# EAGLE design meduza01 (EAGLE 6.3)
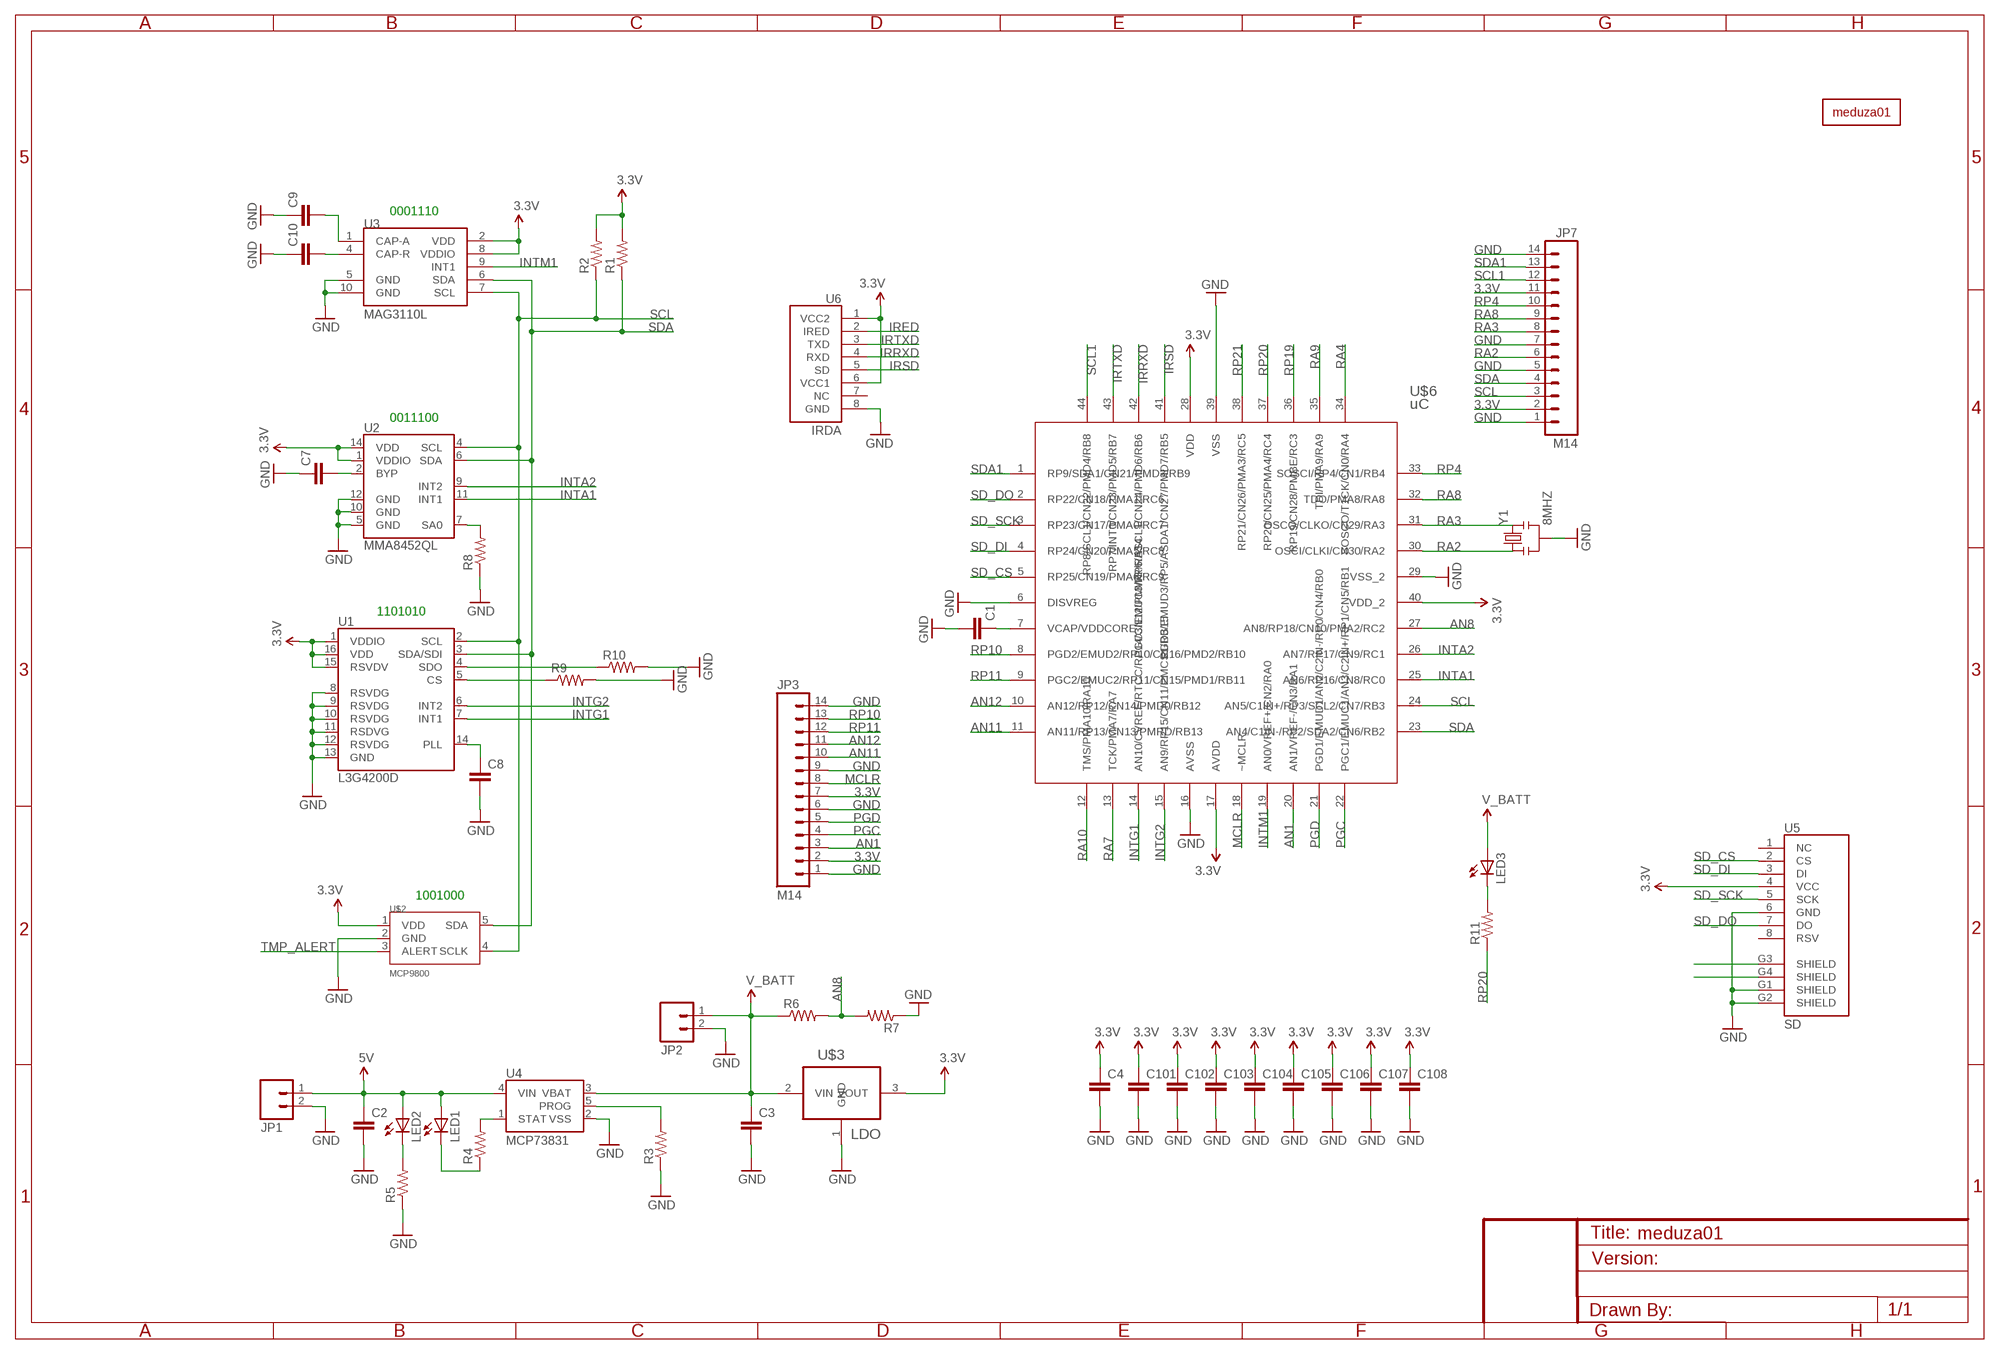
[diagram p0: schematic, sheet 1]

## Parts
C1  CAP0603  [0603]
C2  CAP0805  [0805]
C3  CAP0805  [0805]
C4  CAP0603  [0603]
C7  CAP0603  [0603]
C8  CAP0603  [0603]
C9  CAP0603  [0603]
C10  CAP0603  [0603]
C101  CAP0603  [0603]
C102  CAP0603  [0603]
C103  CAP0603  [0603]
C104  CAP0603  [0603]
C105  CAP0603  [0603]
C106  CAP0603  [0603]
C107  CAP0603  [0603]
C108  CAP0603  [0603]
JP1  M02PTH  [1X02]
JP2  M02PTH  [1X02]
JP3  M14  [1X14]
JP7  M14  [1X14]
LED1  LED1206  [LED-1206]
LED2  LED1206  [LED-1206]
LED3  LED1206  [LED-1206]
R1  RESISTOR0603  [0603]
R2  RESISTOR0603  [0603]
R3  RESISTOR0603  [0603]
R4  RESISTOR0603  [0603]
R5  RESISTOR0603  [0603]
R6  RESISTOR0603  [0603]
R7  RESISTOR0603  [0603]
R8  RESISTOR0603  [0603]
R9  RESISTOR0603  [0603]
R10  RESISTOR0603  [0603]
R11  RESISTOR0603  [0603]
U1  L3G4200D  [LGA16-4X4]
U2  MMA8452QL  [QFN-16_0.5MM-EXTRA]
U3  MAG3110L  [DFN-10-EXTRA]
U4  MCP73831  [SOT23-5]
U5  SD  USD-SOCKETMOLEX47309  [MOLEX-SD-47309]
U6  IRDA  TFDU6300TFDU6300  [TFDU6300]
U$1  MEDUZA01  [MEDUZA01]
U$2  MCP9800  [SOT23-5]
U$3  LDO  MCP1700T-3302E/TTSOT89MCP1700-3N  [SOT89R]
U$6  uC  PIC24FJ64GA004  [QFP80P1200X1200X120-44N]
Y1  8MHZ  RESONATOR8MHZ  [RESONATOR-SMD]

## Nets
3.3V: C4.1 C101.1 C102.1 C103.1 C104.1 C105.1 C106.1 C107.1 C108.1 JP3.2 JP3.7 JP7.2 JP7.11 R1.2 R2.2 U1.1(VDDIO) U1.15(RSVDV) U1.16(VDD) U2.1(VDDIO) U2.14(VDD) U3.2(VDD) U3.8(VDDIO) U5.4(VCC) U6.1(VCC2) U6.6(VCC1) U$2.1(VDD) U$3.3(VOUT) U$6.17(AVDD) U$6.28(VDD) U$6.40(VDD_2)
5V: C2.1 JP1.1 LED1.A LED2.A U4.4(VIN)
ABYP: C7.2 U2.2(BYP)
AN1: JP3.3 U$6.20(AN1/VREF-/CN3/RA1)
AN8: R6.2 R7.2 U$6.27(AN8/RP18/CN10/PMA2/RC2)
AN11: JP3.10 U$6.11(AN11/RP13/CN13/PMRD/RB13)
AN12: JP3.11 U$6.10(AN12/RP12/CN14/PMD0/RB12)
GCS: R9.1 U1.5(CS)
GND: C1.2 C2.2 C3.2 C4.2 C7.1 C8.2 C9.1 C10.1 C101.2 C102.2 C103.2 C104.2 C105.2 C106.2 C107.2 C108.2 JP1.2 JP2.2 JP3.1 JP3.6 JP3.9 JP3.14 JP7.1 JP7.5 JP7.7 JP7.14 R3.1 R5.1 R7.1 R8.1 R9.2 R10.2 U1.8(RSVDG) U1.9(RSVDG) U1.10(RSVDG) U1.11(RSDVG) U1.12(RSVDG) U1.13(GND) U2.5(GND) U2.10(GND) U2.12(GND) U3.5(GND) U3.10(GND) U4.2(VSS) U5.6(GND) U5.G1(SHIELD) U5.G2(SHIELD) U6.8(GND) U$2.2(GND) U$3.1(GND) U$6.6(DISVREG) U$6.16(AVSS) U$6.29(VSS_2) U$6.39(VSS) Y1.2
GPLL: C8.1 U1.14(PLL)
GSDO: R10.1 U1.4(SDO)
INTA1: U2.11(INT1) U$6.25(AN6/RP16/CN8/RC0)
INTA2: U2.9(INT2) U$6.26(AN7/RP17/CN9/RC1)
INTG1: U1.7(INT1) U$6.14(AN10/CVREF/RTCC/RP14/CN12/PMWR/RB14)
INTG2: U1.6(INT2) U$6.15(AN9/RP15/CN11/PMCS1/RB15)
INTM1: U3.9(INT1) U$6.19(AN0/VREF+/CN2/RA0)
IRED: U6.2(IRED)
IRRXD: U6.4(RXD) U$6.42(PGC3/EMUC3/RP6/ASCL1/CN24/PMD6/RB6)
IRSD: U6.5(SD) U$6.41(PGD3/EMUD3/RP5/ASDA1/CN27/PMD7/RB5)
IRTXD: U6.3(TXD) U$6.43(RP7/INT0/CN23/PMD5/RB7)
MCAPA: C9.2 U3.1(CAP-A)
MCAPR: C10.2 U3.4(CAP-R)
MCLR: JP3.8 U$6.18(~MCLR)
N$1: C1.1 U$6.7(VCAP/VDDCORE)
N$2: LED3.C R11.2
N$8: LED1.C R4.1
N$10: LED2.C R5.2
N$12: U5.G3(SHIELD)
N$13: U5.G4(SHIELD)
PGC: JP3.4 U$6.22(PGC1/EMUC1/AN3/C2IN+/RP1/CN5/RB1)
PGD: JP3.5 U$6.21(PGD1/EMUD1/AN2/C2IN-/RP0/CN4/RB0)
PROG: R3.2 U4.5(PROG)
RA2: JP7.6 U$6.30(OSCI/CLKI/CN30/RA2) Y1.1
RA3: JP7.8 U$6.31(OSCO/CLKO/CN29/RA3) Y1.3
RA4: U$6.34(SOSCO/T1CK/CN0/RA4)
RA7: U$6.13(TCK/PMA7/RA7)
RA8: JP7.9 U$6.32(TDO/PMA8/RA8)
RA9: U$6.35(TDI/PMA9/RA9)
RA10: U$6.12(TMS/PMA10/RA10)
RP4: JP7.10 U$6.33(SOSCI/RP4/CN1/RB4)
RP10: JP3.13 U$6.8(PGD2/EMUD2/RP10/CN16/PMD2/RB10)
RP11: JP3.12 U$6.9(PGC2/EMUC2/RP11/CN15/PMD1/RB11)
RP19: U$6.36(RP19/CN28/PMBE/RC3)
RP20: R11.1 U$6.37(RP20/CN25/PMA4/RC4)
RP21: U$6.38(RP21/CN26/PMA3/RC5)
SA0 [POWER]: R8.2 U2.7(SA0)
SCL: JP7.3 R2.1 U1.2(SCL) U2.4(SCL) U3.7(SCL) U$2.4(SCLK) U$6.24(AN5/C1IN+/RP3/SCL2/CN7/RB3)
SCL1: JP7.12 U$6.44(RP8/SCL1/CN22/PMD4/RB8)
SD_CS: U5.2(CS) U$6.5(RP25/CN19/PMA6/RC9)
SD_DI: U5.3(DI) U$6.4(RP24/CN20/PMA5/RC8)
SD_DO: U5.7(DO) U$6.2(RP22/CN18/PMA1/RC6)
SD_SCK: U5.5(SCK) U$6.3(RP23/CN17/PMA0/RC7)
SDA: JP7.4 R1.1 U1.3(SDA/SDI) U2.6(SDA) U3.6(SDA) U$2.5(SDA) U$6.23(AN4/C1IN-/RP2/SDA2/CN6/RB2)
SDA1: JP7.13 U$6.1(RP9/SDA1/CN21/PMD3/RB9)
STAT: R4.2 U4.1(STAT)
TMP_ALERT: U$2.3(ALERT)
V_BATT: C3.1 JP2.1 LED3.A R6.1 U4.3(VBAT) U$3.2(VIN)
Unconnected: U5.1(NC) U5.8(RSV) U6.7(NC)

## Notes on the sheet
- 0001110
- 0011100
- 1101010
- 1001000

## Library data of the parts
C1 C4 C7-C10 C101-C108 = naut:CAP: Capacitor
C2 C3 = SparkFun-Passives:CAP: Capacitor
JP1 JP2 = SparkFun-Connectors:M02: Header 2 Standard 2-pin 0.1" header. Use with straight break away headers (SKU : PRT-00116), right angle break away headers (PRT-00553), swiss pins (PRT-00743), machine pins (PRT-00117), and female headers (PRT-00115). Molex polarized connector foot print use with SKU : PRT-08233 with associated crimp pins and housings.
JP3 JP7 = SparkFun-Connectors:M14: Header 14 Standard 14-pin 0.1" header. Use with straight break away headers (SKU : PRT-00116), right angle break away headers (PRT-00553), swiss pins (PRT-00743), machine pins (PRT-00117), and female headers (PRT-00115).
LED1-LED3 = SparkFun-LED:LED: LEDs Standard schematic elements and footprints for 5mm, 3mm, 1206, and 0603 sized LEDs. 5mm - Spark Fun Electronics SKU : COM-00529 (and others)
R1-R11 = naut:RESISTOR: Resistor
U1 = naut:L3G4200D: L3G4200D Three-axis, digital output gyroscope The L3G4200D is a low-power three-axis angular rate sensor, has a full scale of ±250/±500/±2000 dps and is capable of measuring rates with a user-selectable bandwidth. It includes a sensing element and an IC interface capable of providing the measured angular rate to the external world through a digital interface (I2C/SPI). Package: 4x4x1.1 LGA-16 (LGA16-4x4.PAC)
U2 = naut:MMA8452Q: MMA8452Q 3-Axis, 12/8-bit Digital Accelerometer Supply Voltage: 1.6-3.6V Range: +/- 2g, 4g, 8g Interface: I2C, 12-bit and 8-bit ODR: 1.56 Hz - 800 Hz Package: QFN-16 http://cache.freescale.com/files/sensors/doc/data_sheet/MMA8452Q.pdf
U3 = naut:MAG3110: 3-axis digital (I2C) magnetometer
U4 = SparkFun-PowerIC:MCP73831: Miniature single cell, fully integrated Li-Ion, Li-polymer charge management controller http://ww1.microchip.com/downloads/en/DeviceDoc/21984a.pdf
U5 = naut:USD-SOCKET: microSD Socket Push-push type uSD socket. Schematic element and footprint production proven. Spark Fun Electronics SKU : PRT-00127. tDoc lines correctly indicate media card edge positions when inserting (unlocked, locked, depressed).
U6 = naut:TFDU6300: IRDA
U$1 = naut:MEDUZA01
U$2 = naut:MCP9800: High-Accuracy Temperature Sensor; DESCRIPTION: High-Accuracy Temperature Sensor; MPN: MCP9800; PACKAGE: SSOT23-5; SUPPLIER: MICROCHIP
U$3 = naut:MCP1700T-3302E/TT: Low Quiescent Current LDO
U$6 = naut:PIC24FJ64GA004: 16-Bit Flash Microcontrollers; DESCRIPTION: 16-Bit Flash Microcontrollers; MPN: PIC24FJ64GA004-I/PT; OC_FARNELL: 1332299; OC_NEWARK: 88K6136; PACKAGE: TQFP-44; SUPPLIER: Microchip
Y1 = SparkFun-FreqCtrl:RESONATOR: Resonator Small SMD resonator. Used, eg, on the Arduino Pro/ Pro Mini boards. 8MHz- XTAL-08895 16MHz- XTAL-08900; PROD_ID: XTAL-08895

## Net classes
0 default: width 0.305 mm, drill 0.381 mm, clearance 0.305 mm
1 POWER: width 0.61 mm, drill 0.762 mm, clearance 0.61 mm

## Board
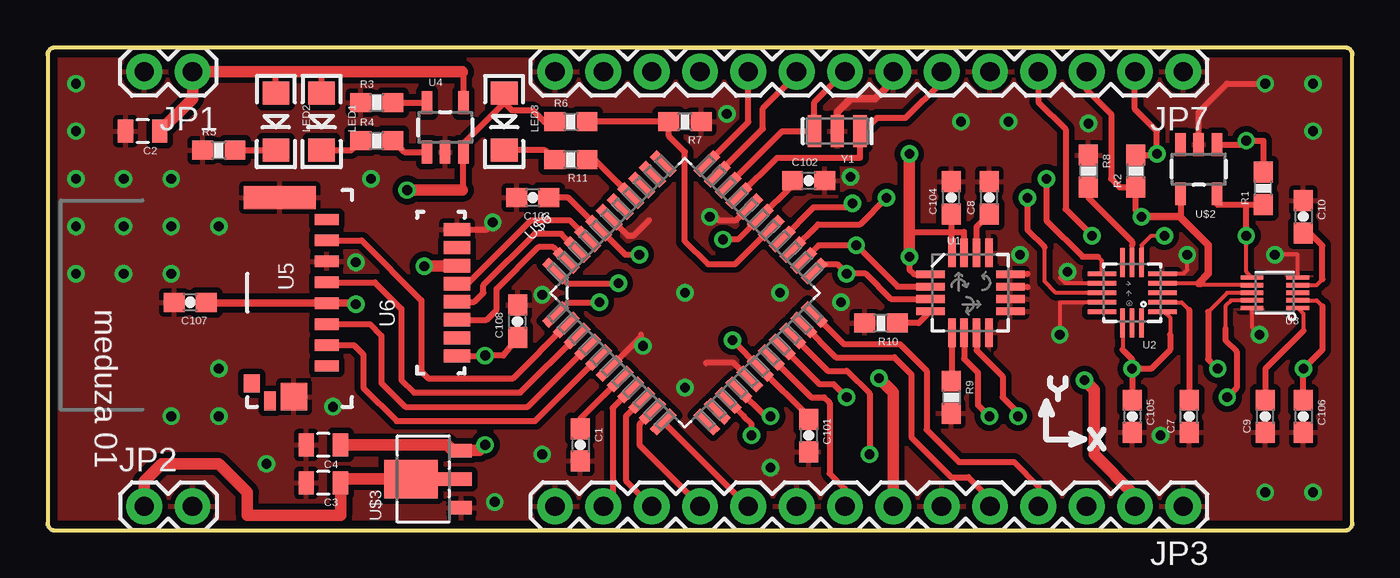
[diagram p1: board, top side]
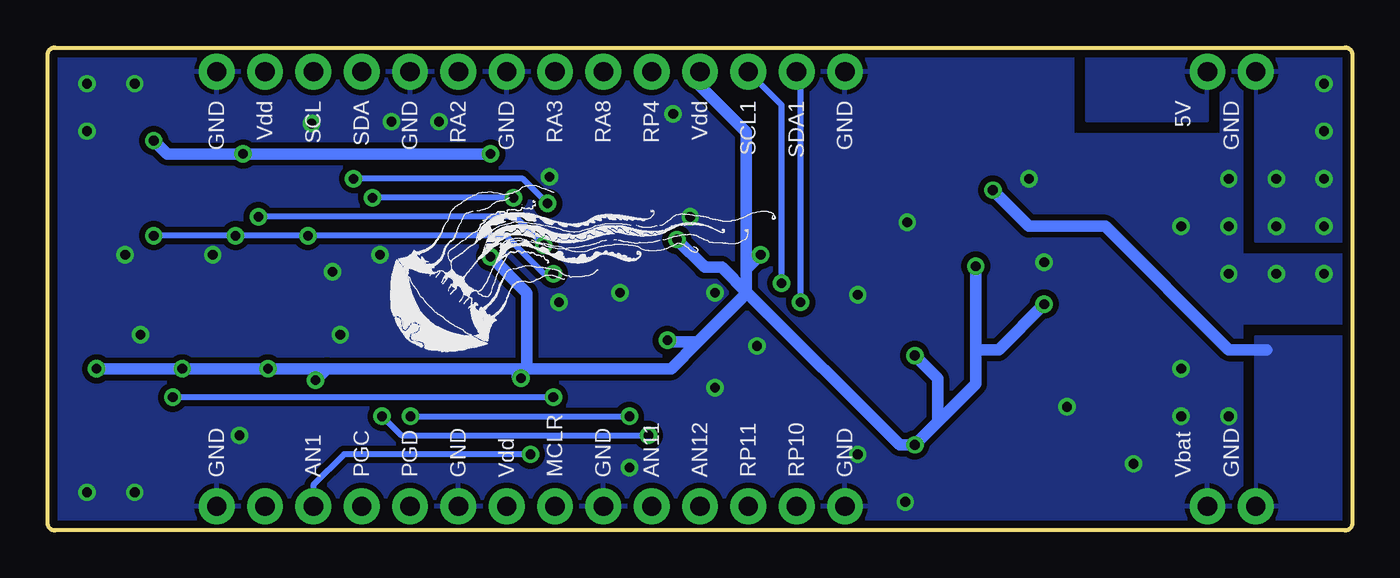
[diagram p2: board, bottom side, seen from below]

Size 68.58 x 25.4 mm. Coordinates in mm from the lower left corner, seen from the top.
Outline: 0.38,0 68.2,0 arc90 68.58,0.38 68.58,25.02 arc90 68.2,25.4 0.38,25.4 arc90 0,25.02 0,0.38 arc90 0.38,0
Copper layers (1*16): Top 0.035mm / dielectric 1.5mm / Bottom 0.035mm
Design rules "default *": minimum track width 8mil, minimum drill 20mil, track to track 8mil, track to pad 8mil, pad to pad 8mil, via to via 8mil, smd to smd 8mil, copper to edge 16mil, drill to drill 8mil, minimum pad ring 10mil, minimum via ring 8mil, stop-mask expansion 4mil, vias tented up to drill 20mil, thermal gap 10mil
tRestrict: area 47,11 to 50,14; area 55.5,11 to 58.5,14; area 64,11.4 to 65,13.6; area 59.5,18 to 61.5,20

### Footprints (pad centres in the part's own frame; a part is rotated, then mirrored left to right if it is on the bottom)
0603-CAP = smd 1.1 x 1: 1 -0.85,0; 2 0.85,0
0805 = smd 0.8 x 1.2: 1 -0.9,0; 2 0.9,0
1X02 = drill 1.016 pad 1.88: 1 0,0; 2 2.54,0
1X14 = drill 1.016 pad 1.88: 1 0,0; 2 2.54,0; 3 5.08,0; 4 7.62,0; 5 10.16,0; 6 12.7,0; 7 15.24,0; 8 17.78,0; 9 20.32,0; 10 22.86,0; 11 25.4,0; 12 27.94,0; 13 30.48,0; 14 33.02,0
LED-1206 = smd 1.2 x 1.4: A -1.5,0; C 1.5,0
0603-RES = smd 1.1 x 1: 1 -0.85,0; 2 0.85,0
LGA16-4X4 = smd 1.5 x 0.4: 1 -2.1,0.975; 2 -2.1,0.325; 3 -2.1,-0.325; 4 -2.1,-0.975; 9 2.1,-0.975; 10 2.1,-0.325; 11 2.1,0.325; 12 2.1,0.975 | smd 0.4 x 1.5: 5 -0.975,-2.1; 6 -0.325,-2.1; 7 0.325,-2.1; 8 0.975,-2.1; 13 0.975,2.1; 14 0.325,2.1; 15 -0.325,2.1; 16 -0.975,2.1
QFN-16_0.5MM-EXTRA = smd 1.5 x 0.25: 1 -1.59,1; 2 -1.59,0.5; 3 -1.59,0; 4 -1.59,-0.5; 5 -1.59,-1; 9 1.59,-1; 10 1.59,-0.5; 11 1.59,0; 12 1.59,0.5; 13 1.59,1 | smd 0.25 x 1.5: 6 -0.5,-1.59; 7 0,-1.59; 8 0.5,-1.59; 14 0.5,1.59; 15 0,1.59; 16 -0.5,1.59
DFN-10-EXTRA = smd 1.2 x 0.225: 1 -1.2,0.8; 2 -1.2,0.4; 3 -1.2,0; 4 -1.2,-0.4; 5 -1.2,-0.8; 6 1.2,-0.8; 7 1.2,-0.4; 8 1.2,0; 9 1.2,0.4; 10 1.2,0.8
SOT23-5 = smd 0.55 x 1.2: 1 -0.95,-1.3; 2 0,-1.3; 3 0.95,-1.3; 4 0.95,1.3; 5 -0.95,1.3
MOLEX-SD-47309 = smd 0.6 x 1.25: 1 3.85,-1.325; 2 2.75,-1.325; 3 1.65,-1.325; 4 0.55,-1.325; 5 -0.55,-1.325; 6 -1.65,-1.325; 7 -2.75,-1.325; 8 -3.85,-1.325 | smd 1.2 x 3.79: G1 -5,-3.805 | smd 1.45 x 1.4: G2 5.475,-3.05 | smd 1 x 0.6: G3 5.7,-4.3 | smd 0.95 x 0.85: G4 4.775,-5.275
TFDU6300 = smd 0.7 x 1.4: 1 -3.325,-1.02; 2 -2.375,-1.02; 3 -1.425,-1.02; 4 -0.475,-1.02; 5 0.475,-1.02; 6 1.425,-1.02; 7 2.375,-1.02; 8 3.325,-1.02
SOT89R = smd 0.7 x 1.1: 1 -1.5,-1.75; 3 1.5,-1.75 | smd 0.7 x 1.8: 2 0,-1.4 | smd 2 x 2.8: 4 0,0.9
QFP80P1200X1200X120-44N = smd 1.5 x 0.508: 1 -5.613,4; 2 -5.613,3.2; 3 -5.613,2.4; 4 -5.613,1.6; 5 -5.613,0.8; 6 -5.613,0; 7 -5.613,-0.8; 8 -5.613,-1.6; 9 -5.613,-2.4; 10 -5.613,-3.2; 11 -5.613,-4; 23 5.613,-4; 24 5.613,-3.2; 25 5.613,-2.4; 26 5.613,-1.6; 27 5.613,-0.8; 28 5.613,0; 29 5.613,0.8; 30 5.613,1.6; 31 5.613,2.4; 32 5.613,3.2; 33 5.613,4 | smd 0.508 x 1.5: 12 -4,-5.613; 13 -3.2,-5.613; 14 -2.4,-5.613; 15 -1.6,-5.613; 16 -0.8,-5.613; 17 0,-5.613; 18 0.8,-5.613; 19 1.6,-5.613; 20 2.4,-5.613; 21 3.2,-5.613; 22 4,-5.613; 34 4,5.613; 35 3.2,5.613; 36 2.4,5.613; 37 1.6,5.613; 38 0.8,5.613; 39 0,5.613; 40 -0.8,5.613; 41 -1.6,5.613; 42 -2.4,5.613; 43 -3.2,5.613; 44 -4,5.613
RESONATOR-SMD = smd 0.7 x 1.7: 1 -1.2,0; 2 0,0; 3 1.2,0

### Placement (x,y rotation side)
C1  [0603-CAP]  28,4.5 270 top
C2  5,21 180 top
C3  14.5,2.5 180 top
C4  [0805]  14.5,4.5 180 top
C7  [0603-CAP]  60,6 90 top
C8  [0603-CAP]  49.5,17.5 90 top
C9  [0603-CAP]  64,6 90 top
C10  [0603-CAP]  66,16.5 270 top
C101  [0603-CAP]  40,4.99 270 top
C102  [0603-CAP]  40,18.4 0 top
C103  [0603-CAP]  25.5,17.5 180 top
C104  [0603-CAP]  47.5,17.5 90 top
C105  [0603-CAP]  57,6 270 top
C106  [0603-CAP]  66,6 270 top
C107  [0603-CAP]  7.5,12 180 top
C108  [0603-CAP]  24.7,11 90 top
JP1  7.62,24.13 180 top
JP2  5.08,1.27 0 top
JP3  59.69,1.27 180 top
JP7  59.69,24.13 180 top
LED1  14.4,21.5 270 top
LED2  12,21.5 270 top
LED3  24,21.5 270 top
R1  [0603-RES]  63.9,18 90 top
R2  [0603-RES]  57.2,18.9 90 top
R3  [0603-RES]  17.3,22.5 0 top
R4  [0603-RES]  17.3,20.5 0 top
R5  [0603-RES]  9,20 0 top
R6  [0603-RES]  27.5,21.5 0 top
R7  [0603-RES]  33.5,21.5 180 top
R8  [0603-RES]  54.7,18.9 270 top
R9  [0603-RES]  47.5,7 270 top
R10  [0603-RES]  43.8,10.9 180 top
R11  [0603-RES]  27.5,19.5 180 top
U1  48.5,12.5 0 top
U2  57,12.5 180 top
U3  64.5,12.5 180 top
U4  20.9,21.2 0 top
U5  16,12.5 270 top
U6  20.5,12.5 90 top
U$1  47.8,11.95 90 bottom
U$2  60.5,19 180 top
U$3  20,2.7 90 top
U$6  33.5,12.5 45 top
Y1  41.5,21 180 top

### Tracks (layer width: path | path; a pad name or v marks a point on that pad's centre or on a via)
3.3V  (via drill 0.51)
  Top 0.203: U3.8 62,12.5 61,11.5 | U2.14 56.5,9.5 | U2.1 58.7,11.5 59,11.2 59,10.3 | U3.2 66.7,12.1 67,11.8
  Top 0.305: v57,8.5 C105.1 | C106.1 v66,8.5 67,9.5 67,11.8 | 56.5,9.5 57,9 v57,8.5 | 61,11.5 61,9 v61.5,8.5 | 59,10.3 59,9.5 58,8.5 v57,8.5 | 28.95,15.9 U$6.40 | U$6.40 30.37,14.5 v31.1,14.5 | v36,10 U$6.17 40,6 C101.1 | v36,10 | v35.5,15.3 36.3,15.3 U$6.28 39.15,18.15 C102.1 | C108.1 23.95,9.2 v23,9.2 23,9.18 U6.1 | 45.3,15.7 47.5,15.7 | 47.52,15.7 48.17,15.7 U1.15 | R2.2 58.3,19.75 v58.3,19.8 58.3,21 57.15,22.15 JP7.2 | R1.2 63.9,20.5 v63,20.5 63,20.3 U$2.1 | U$6.40 27.37,17.5 C103.1 | v45.3,14.4 45.3,13.7 45.52,13.47 U1.1 | U1.16 47.52,15.7 | C104.1 47.5,15.7 | 47.5,15.7 47.52,15.7
  Top 0.406: v16.2,11.9 16.15,11.95 U5.4 8.4,11.95 C107.1
  Top 0.61: v23,4.5 22.7,4.2 U$3.3 21.3,4.2 21,4.5 C4.1 | U6.6 21.5,13.9 v19.8,13.9 | v45.3,14.4 45.3,15.7 v45.3,19.8 | JP3.7 44.45,7.25 v43.7,8 | JP3.2 57.15,1.85 55,4 55,7.4 v54.5,7.9
  Bottom 0.61: 53.9,8.5 v57,8.5 v61.5,8.5 v66,8.5 | 53.9,8.5 43.4,8.5 | 43.4,8.5 35.8,8.5 34.4,9.9 | 31.8,12.5 33.15,13.85 34.05,13.85 v35.5,15.3 | 34.4,9.9 31.85,12.45 | 31.85,12.45 31.8,12.5 | 31.8,12.5 23.8,4.5 v23,4.5 21.8,5.7 | 21.8,5.7 19.8,7.7 19.8,9.5 | 19.8,9.5 v19.8,13.9 | v23,9.2 21.8,8 21.8,5.7 | v16.2,11.9 18.6,9.5 19.8,9.5 | v36,10 35.9,9.9 34.4,9.9 | v45.3,14.4 43.4,12.5 43.4,8.6 | 43.4,8.6 43.4,8.5 | v43.7,8 43.9,8.1 43.4,8.6 | v63,20.5 62.3,19.8 v58.3,19.8 v45.3,19.8 | JP7.11 34.29,23.39 31.85,20.95 31.85,13.8 | 31.85,13.8 31.85,12.45 | v31.1,14.5 31.8,13.8 31.85,13.8 | v54.5,7.9 53.9,8.5
5V
  Top 0.305: LED2.A 12,24.13 12.1,24.13 | LED1.A 14.4,24.13 | 21.8,24.1 21.85,24.1 U4.4
  Top 0.61: 12.1,24.13 14.4,24.13 21.8,24.13 21.8,24.1 | 12,24.13 JP1.1 7.62,22.72 C2.1
  pour Bottom: 7.62,25.4 13.97,25.4 13.97,21.59 7.62,21.59
ABYP
  Top 0.203: U2.2 59.6,12 60,11.6
  Top 0.305: 60,11.6 C7.2
AN1  (via drill 0.51)
  Top 0.305: U$6.20 40.99,8.4 42,8.4 43.2,7.2 v43.2,4
  Bottom 0.305: v43.2,4 53,4 54.61,2.39 JP3.3
AN8
  Top 0.305: U$6.27 36.13,14 34.7,14 33.5,15.2 33.5,19.9 32.65,20.75 R7.2 R6.2
AN11
  Top 0.305: U$6.11 36.79,1.27 JP3.10
AN12
  Top 0.305: U$6.10 31.1,5.58 31.1,4.5 34.29,1.31 JP3.11
GCS
  Top 0.305: 47.52,8.18 R9.1 47.52,7.88 U1.5
GND  (via drill 0.51)
  Top 0.203: U2.5 59.7,13.5 59.9,13.7 v59.9,14.5 | U2.10 53.5,13 53.2,13.3 v53.6,13.6 | U2.12 53.2,12 v53.2,10.3 | U3.10 63.3,10.7 v63.7,10.3 | U3.5 65.7,14.5 v64.5,14.5
  Top 0.305: U6.8 23.07,15.82 v23.4,16.2 | U$6.39 30.5,15.5 30.8,15.5 31.6,16.3 | U$6.29 36.17,16.3 35.3,16.3 35.1,16.5 v34.8,16.5 | U$6.6 31.2,10.2 31.2,10.3 | U$6.16 36.07,8.8 34.6,8.8 | U$2.2 60.5,22 62,23.5 v64,23.5 | 51.48,12.82 51.5,12.8 | 51.48,13.47 51.5,13.5
  Top 0.406: Y1.2 41.5,22 42.2,22.7 43.5,22.7 44.45,23.65 JP7.7
  other vias: 16.2,14.1 38,3.3 17,18.5 26,12.4 33.5,7.5 38.5,12.5 66.5,21 4,16 6.5,16 15,6.5 4,13.5 6.5,18.5 64,2 58.5,5 42.2,18.6 41.7,12 1.5,16 35.7,21.9 48,21.5 54.7,21.4 23.5,1.5 31.3,9.7 33.5,12.5 6.5,6 4,18.5 1.5,18.5 1.5,21 9,16 1.5,23.5 6.5,13.5 1.5,13.5 9,6 9,8.5 11.5,3.5 66.5,23.5 66.5,2 51.1,14.5 26,4 50.5,21.5
  pour Bottom: 68.2,25.4 14.73,25.4 14.73,20.83 6.86,20.83 6.86,25.4 5.84,25.4 5.84,14.48 0,14.48 0,10.92 5.84,10.92 5.84,0 68.2,0 arc90 68.58,0.38 68.58,25.02 arc90
  pour Top: 2.03,25.4 66.55,25.4 arc-90 68.58,23.37 68.58,2.03 arc-90 66.55,0 2.03,0 arc-90 0,2.03 0,23.37 arc-90
  pour Bottom: 0,25.4 5.08,25.4 5.08,15.24 0,15.24
GPLL
  Top 0.305: U1.14 48.83,15.97 C8.1
GSDO
  Top 0.305: U1.4 45.77,10.9 R10.1
INTA1  (via drill 0.51)
  Top 0.203: U2.11 53,12.5 52.4,13.1 52.4,14.9
  Top 0.305: U$6.25 40.49,16.1 42.7,16.1 v44.1,17.5 | v51.5,17.5 51.5,15.8 52.4,14.9
  Bottom 0.305: v44.1,17.5 v51.5,17.5
INTA2  (via drill 0.51)
  Top 0.203: U2.9 55.41,14.19 55.2,14.4
  Top 0.305: U$6.26 40.26,17 42.1,17 v42.3,17.2 | v52.5,18.5 52.5,16.3 54.4,14.4 55.2,14.4
  Bottom 0.305: v42.3,17.2 43.6,18.5 v52.5,18.5
INTG1  (via drill 0.51)
  Top 0.305: v51,6 51,6.2 50.2,7 50.2,8.1 48.83,9.47 U1.7 | v37,5 37,5.6 36.6,6.01 U$6.14
  Bottom 0.305: v51,6 50,5 v37,5
INTG2  (via drill 0.51)
  Top 0.305: U$6.15 37.74,6 v38,6 | U1.6 48.17,9.03 48.9,8.3 48.9,6.6 v49.5,6
  Bottom 0.305: v49.5,6 v38,6
INTM1  (via drill 0.51)
  Top 0.203: U3.9 62.2,12.1 61.9,11.8 61.9,10.6
  Top 0.305: 61.9,10.6 61.9,10 62.5,9.4 62.5,7.5 v62,7 | U$6.19 40.56,7.7 41.3,7.7 v42,7
  Bottom 0.305: v42,7 v62,7
IRRXD
  Top 0.305: U6.4 22.43,12.03 22.9,12.5 22.9,12.9 25.6,15.6 27.01,15.6 U$6.42
IRSD
  Top 0.305: U6.5 22.07,12.97 25.4,16.3 27.44,16.3 U$6.41
IRTXD
  Top 0.305: U6.3 23.07,11.07 23.6,11.6 23.6,12.7 25.8,14.9 26.57,14.9 U$6.43
MCAPA
  Top 0.203: U3.1 66,11.4 66,10.5
  Top 0.305: 66,10.5 64,8.5 C9.2
MCAPR
  Top 0.203: U3.4 66.7,12.9 67,13.2
  Top 0.305: 67,13.2 67,14.98 66.33,15.65 C10.2
MCLR
  Top 0.305: U$6.18 40.13,7 40.8,7 41.1,6.7 41.1,3 41.91,2.19 JP3.8
N$1
  Top 0.305: U$6.7 27.98,5.85 C1.1
N$2
  Top 0.305: R11.2 26.15,20 LED3.C
N$8
  Top 0.305: LED1.C 15.95,20 R4.1
N$10
  Top 0.305: R5.2 LED2.C
PGC
  Top 0.305: U$6.22 41.86,9.8 44.8,9.8 46.2,8.4 46.2,5.3 47.9,3.6 50.8,3.6 52.07,2.33 JP3.4
PGD
  Top 0.305: U$6.21 41.42,9.1 44.5,9.1 45.4,8.2 45.4,4.9 47.5,2.8 48.4,2.8 49.53,1.67 JP3.5
PROG
  Top 0.305: R3.2 | R3.2 U4.5
RA2
  Top 0.305: U$6.30 38.34,19.6 42.7,19.6 Y1.1 42.9,21 43.6,21.7 45.1,21.7 46.99,23.59 JP7.6
RA3
  Top 0.305: JP7.8 40.3,22.52 Y1.3 38.61,21 U$6.31
RA8
  Top 0.305: U$6.32 37.6,21.12 37.6,22.2 39.37,23.97 JP7.9
RP4
  Top 0.305: U$6.33 36.83,21.49 JP7.10
RP10
  Top 0.305: U$6.8 29.7,6.44 29.7,1.76 JP3.13
RP11
  Top 0.305: U$6.9 30.4,6.01 30.4,2.62 JP3.12
RP20
  Top 0.305: U$6.37 28.76,19.5 R11.1
SA0
  Top 0.203: U2.7 57,15
  Top 0.305: R8.2 54.7,17.5 57,15.2 57,15
SCL  (via drill 0.51)
  Top 0.203: U3.7 60.6,12.9 60.5,13 U2.4
  Top 0.305: U$6.24 40.52,15 v42.5,15 44.67,12.82 U1.2 | U$2.4 59.55,16.45 59.6,16.4 | v57.5,16.5 57.2,16.8 R2.1 56.35,18.05 55.9,18.5 55.9,21.9 54.61,23.19 JP7.3
  Top 0.406: 60.5,13 61,13.5 61,15 59.6,16.4 59.5,16.5 v57.5,16.5
  Bottom 0.305: v42.5,15 44,16.5 v57.5,16.5
SCL1  (via drill 0.51)
  Top 0.305: U$6.44 27.34,13 v30,13
  Bottom 0.305: v30,13 30,22.38 JP7.12
SD_CS
  Top 0.305: U5.2 16.1,9.75 16.6,9.25 16.6,7.5 18.35,5.75 25.62,5.75 U$6.5
SD_DI
  Top 0.305: U5.3 16.95,10.85 17.55,10.25 17.55,7.75 18.8,6.5 25.24,6.5 U$6.4
SD_DO
  Top 0.305: U5.7 16.5,15.25 19.65,12.1 19.65,8.35 20,8 24.48,8 U$6.2
SD_SCK
  Top 0.305: U5.5 17.2,13.05 18.6,11.65 18.6,7.9 19.25,7.25 24.86,7.25 U$6.3
SDA  (via drill 0.51)
  Top 0.203: v63,15.5 63,13.6 U3.6 | U2.6 57.5,15 58,15.5 v58.7,15.5
  Top 0.305: U$6.23 40.66,14 41.5,14 v42,13.5 43,13.5 44.33,12.18 U1.3 | U$2.5 61.45,17.15 R1.1 63,17.15 v63,15.5 | JP7.4 52.07,22.53 53.5,21.1 53.5,16.9 v54.9,15.5
  Bottom 0.305: v42,13.5 42.5,13.5 44.5,15.5 v54.9,15.5 v58.7,15.5 v63,15.5
SDA1  (via drill 0.51)
  Top 0.305: U$6.1 27.34,12 v29,12
  Bottom 0.305: v29,12 29,23.92 JP7.13
STAT
  Top 0.305: R4.2 18.75,19.9 U4.1
V_BATT  (via drill 0.51)
  Top 0.305: 21.8,17.9 21.85,17.9 U4.3 21.85,20.35 24,22.5 | 24,22.5 LED3.A | 24,22.5 24.4,22.1 25.5,22.1 26.1,21.5 R6.1
  Top 0.61: v18.9,17.9 21.8,17.9 | U$3.2 15.6,2.7 C3.1 15.4,0.8 10.5,0.8 10.5,2 9,3.5 6,3.5 5.08,2.58 JP2.1
  Bottom 0.61: v18.9,17.9 17,16 13,16 6.5,9.5 4.5,9.5
  pour Bottom: 0,10.16 5.08,10.16 5.08,0 0,0

### Text on the board
tPlace: meduza 01
bPlace: GND | 5V | GND | SDA1 | SCL1 | Vdd | RP4 | RA8 | RA3 | GND | RA2 | GND | SDA | SCL | Vdd | GND | GND | Vbat | GND | RP10 | RP11 | AN12 | AN11 | GND | MCLR | Vdd | GND | PGD | PGC | AN1 | GND